# Altium project Follow Line Robot Controller2.PrjPcb
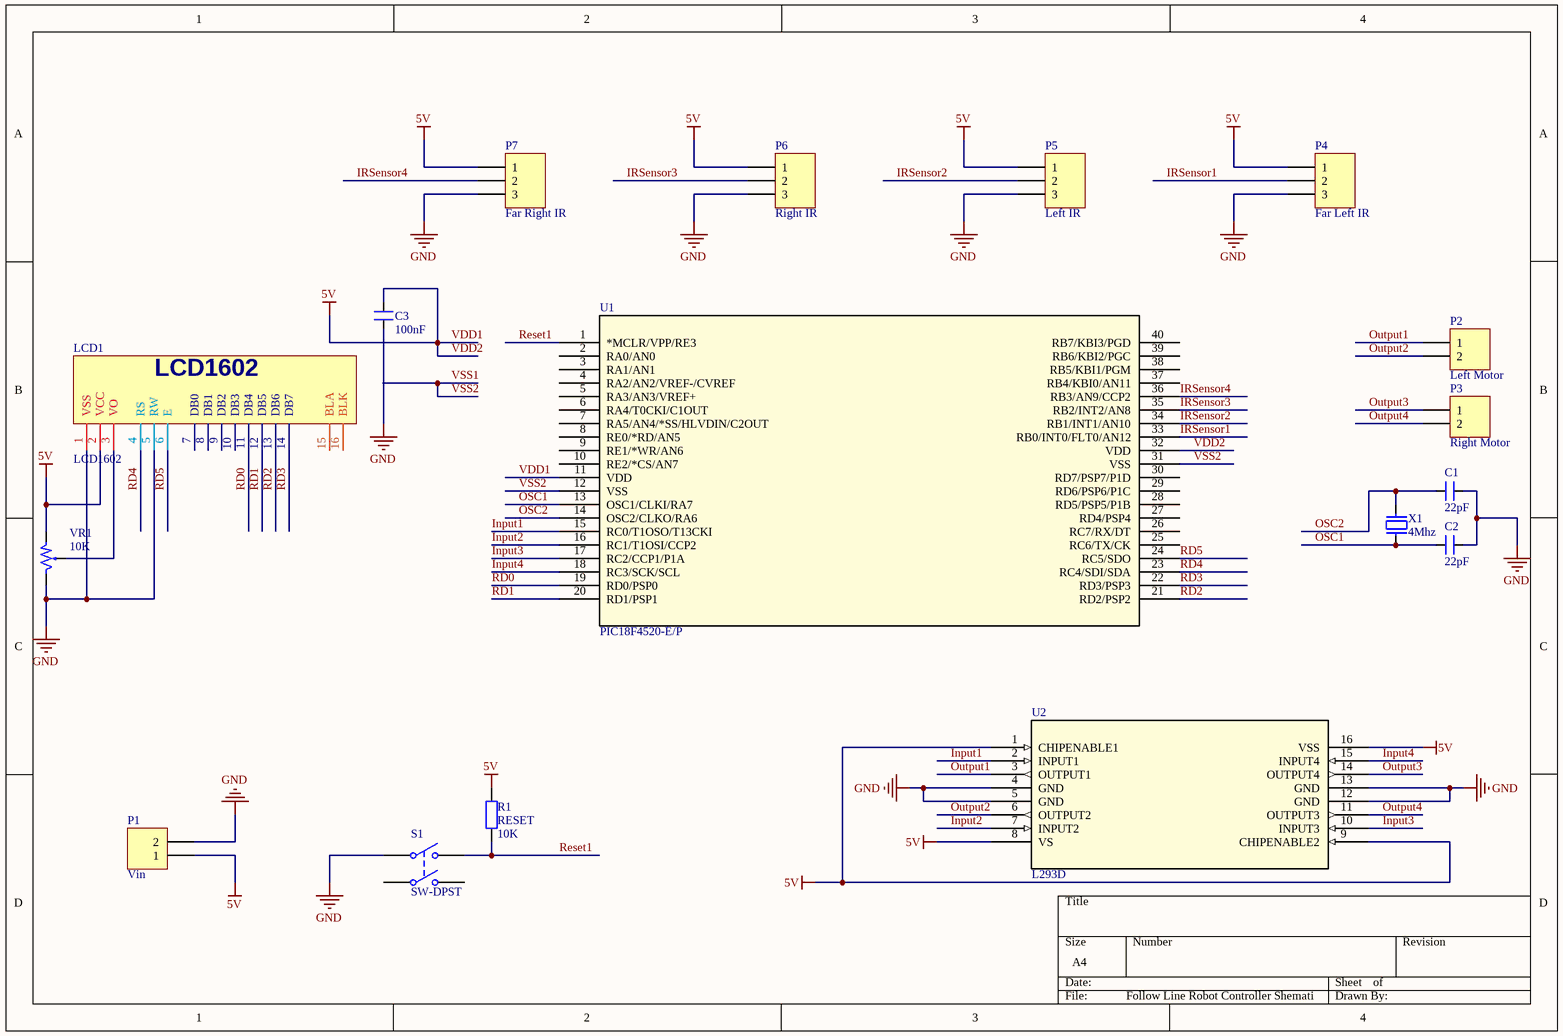
[diagram p0: Follow Line Robot Controller Shematic.SchDoc]
1 sheet, 17 parts. Net scope: global (net labels, ports and power ports of the same name join across sheets).
Board file: Follow Line Robot Controller PCB.PcbDoc

## Sheet Follow Line Robot Controller Shematic.SchDoc
size A4; SheetNumber: 1; SheetTotal: 1

### Parts
C1  value 22pF  [CN3]  (hidden comment: Cap Cer)
C2  value 22pF  [CN3]  (hidden comment: Cap Cer)
C3  value 100nF  [CN3]  (hidden comment: Cap Cer)
LCD1  LCD1602  [LCD1602]
P1  Vin  [HDR1X2]
P2  Left Motor  [HDR1X2]
P3  Right Motor  [HDR1X2]
P4  Far Left IR  [HDR1X3]
P5  Left IR  [HDR1X3]
P6  Right IR  [HDR1X3]
P7  Far Right IR  [HDR1X3]
R1  RESET  value 10K  [SMD R1206]
S1  SW-DPST  [DPST-4]
U1  PIC18F4520-E/P  [PDIP40_600MC_MCH]
U2  L293D  [PowerDIP-16_STM]
VR1  10K  [VR]
X1  4Mhz  [XT2]

### Nets
GND: C1.2 C2.2 C3.1 LCD1.1(VSS) LCD1.5(RW) P1.2 P4.3 P5.3 P6.3 P7.3 S1.1(COMMON1) U2.4(GND) U2.5(GND) U2.12(GND) U2.13(GND) VR1.3
VDD1: C3.2 LCD1.2(VCC) P1.1 P4.1 P5.1 P6.1 P7.1 R1.2 U1.11(VDD) U1.32(VDD) U2.1(CHIPENABLE1) U2.8(VS) U2.9(CHIPENABLE2) U2.16(VSS) VR1.1  [also labelled 5V, VDD2]
Input1: U1.15(RC0/T1OSO/T13CKI) U2.2(INPUT1)
Input2: U1.16(RC1/T1OSI/CCP2) U2.7(INPUT2)
Input3: U1.17(RC2/CCP1/P1A) U2.10(INPUT3)
Input4: U1.18(RC3/SCK/SCL) U2.15(INPUT4)
IRSensor1: P4.2 U1.33(RB0/INT0/FLT0/AN12)
IRSensor2: P5.2 U1.34(RB1/INT1/AN10)
IRSensor3: P6.2 U1.35(RB2/INT2/AN8)
IRSensor4: P7.2 U1.36(RB3/AN9/CCP2)
OSC1: C2.1 U1.13(OSC1/CLKI/RA7) X1.1
OSC2: C1.1 U1.14(OSC2/CLKO/RA6) X1.2
Output1: P2.1 U2.3(OUTPUT1)
Output2: P2.2 U2.6(OUTPUT2)
Output3: P3.1 U2.14(OUTPUT4)
Output4: P3.2 U2.11(OUTPUT3)
RD0: LCD1.11(DB4) U1.19(RD0/PSP0)
RD1: LCD1.12(DB5) U1.20(RD1/PSP1)
RD2: LCD1.13(DB6) U1.21(RD2/PSP2)
RD3: LCD1.14(DB7) U1.22(RD3/PSP3)
RD4: LCD1.4(RS) U1.23(RC4/SDI/SDA)
RD5: LCD1.6(E) U1.24(RC5/SDO)
Reset1: R1.1 S1.2(NO1) U1.1(*MCLR/VPP/RE3)
VSS1: U1.12(VSS) U1.31(VSS)  [also labelled VSS2]
NetLCD1_3: LCD1.3(VO) VR1.2

Not connected (* = marked no-connect by the designer): LCD1 7(DB0) 8(DB1) 9(DB2) 10(DB3) 15(BLA) 16(BLK); S1 3(COMMON2) 4(NO2); U1 2(RA0/AN0) 3(RA1/AN1) 4(RA2/AN2/VREF-/CVREF) 5(RA3/AN3/VREF+) 6(RA4/T0CKI/C1OUT) 7(RA5/AN4/*SS/HLVDIN/C2OUT) 8(RE0/*RD/AN5) 9(RE1/*WR/AN6) 10(RE2/*CS/AN7) 25(RC6/TX/CK) 26(RC7/RX/DT) 27(RD4/PSP4) 28(RD5/PSP5/P1B) 29(RD6/PSP6/P1C) 30(RD7/PSP7/P1D) 37(RB4/KBI0/AN11) 38(RB5/KBI1/PGM) 39(RB6/KBI2/PGC) 40(RB7/KBI3/PGD)

### Library data of the parts
C1-C3 = CN3: Cap np W0.3
P1-P3 = Header 2: Header, 2-Pin; LatestRevisionDate: 17-Jul-2002; LatestRevisionNote: Re-released for DXP Platform.; Publisher: Altium Limited
P4-P7 = Header 3: Header, 3-Pin; LatestRevisionDate: 17-Jul-2002; LatestRevisionNote: Re-released for DXP Platform.; Publisher: Altium Limited
R1 = Res2_1: Resistor; Published: 8-Jun-2000; LatestRevisionDate: 17-Jul-2002; LatestRevisionNote: Re-released for DXP Platform.; PackageReference: AXIAL-0.4; Publisher: Altium Limited; PackageDescription: Axial Device, Thru-Hole; 2 Leads; 0.4 in Pin Spacing
S1 = SW-DPST: Double-Pole, Single-Throw Switch; Published: 24-Mar-1999; LatestRevisionDate: 17-Jul-2002; LatestRevisionNote: Re-released for DXP Platform.; PackageReference: DPST-4; Publisher: Altium Limited; PackageDescription: Switch; 4 Leads
U1 = PIC18F4520-E/P: No Description Available; Mfr_Name: Microchip; Copyright: Copyright (C) 2022 Ultra Librarian. All rights reserved.; Manufacturer_Part_Number: PIC18F4520-E/P; RefDes: RefDes; Type: DEV
U2 = L293D: No Description Available; Mfr_Name: STMicroelectronics; Copyright: Copyright (C) 2022 Ultra Librarian. All rights reserved.; Manufacturer_Part_Number: L293D; RefDes: RefDes; Type: DEV
VR1 = VR1: Var Resistor; Value: VR 10K
X1 = XT2: Crystal For all Crystal 2pin.; Value: 4Mhz